# Altium schematic sheet Sheet2.SchDoc
size A4
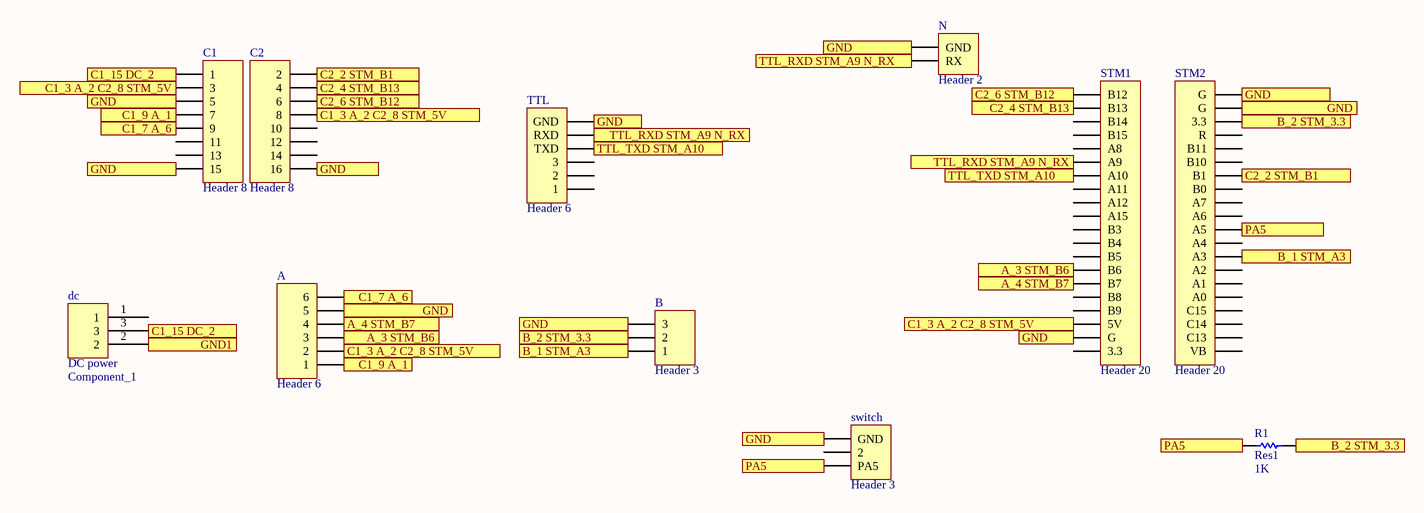
[diagram p0: Sheet2.SchDoc]

## Parts
A  Header 6  [HDR1X6]
B  Header 3  [HDR1X3]
C1  Header 8  [HDR1X8]
C2  Header 8  [HDR1X8]
dc  Component_1  [PCBComponent_1]
N  Header 2  [HDR1X2]
R1  Res1  value 1K  [AXIAL-0.3]
STM1  Header 20  [HDR1X20]
STM2  Header 20  [HDR1X20]
switch  Header 3  [HDR1X3]
TTL  Header 6  [HDR1X6]

## Ports
A_3 STM_B6, A_4 STM_B7, B_1 STM_A3, B_2 STM_3.3, C1_3 A_2 C2_8 STM_5V, C1_7 A_6, C1_9 A_1, C1_15 DC_2, C2_2 STM_B1, C2_4 STM_B13, C2_6 STM_B12, GND, GND1, PA5, TTL_RXD STM_A9 N_RX, TTL_TXD STM_A10

## Nets
A_3 STM_B6: A.3 STM1.14(B6) ; port A_3 STM_B6
A_4 STM_B7: A.4 STM1.15(B7) ; port A_4 STM_B7
B_1 STM_A3: B.3(1) STM2.8(A3) ; port B_1 STM_A3
B_2 STM_3.3: B.2 R1.2 STM2.18(3.3) ; port B_2 STM_3.3
C1_3 A_2 C2_8 STM_5V: A.2 C1.2(3) C2.5(8) STM1.18(5V) ; port C1_3 A_2 C2_8 STM_5V
C1_7 A_6: A.6 C1.5(9) ; port C1_7 A_6
C1_9 A_1: A.1 C1.4(7) ; port C1_9 A_1
C1_15 DC_2: C1.1 dc.3 ; port C1_15 DC_2
C2_2 STM_B1: C2.8(2) STM2.14(B1) ; port C2_2 STM_B1
C2_4 STM_B13: C2.7(4) STM1.2(B13) ; port C2_4 STM_B13
C2_6 STM_B12: C2.6 STM1.1(B12) ; port C2_6 STM_B12
GND: A.5 B.1(3) C1.3(5) C1.8(15) C2.1(16) N.1(GND) STM1.19(G) STM2.19(G) STM2.20(G) switch.1(GND) TTL.6(GND) ; port GND
GND1: dc.2 ; port GND1
PA5: R1.1 STM2.10(A5) switch.3(PA5) ; port PA5
TTL_RXD STM_A9 N_RX: N.2(RX) STM1.6(A9) TTL.5(RXD) ; port TTL_RXD STM_A9 N_RX
TTL_TXD STM_A10: STM1.7(A10) TTL.4(TXD) ; port TTL_TXD STM_A10

Not connected (* = marked no-connect by the designer): C1 6(11) 7(13); C2 2(14) 3(12) 4(10); dc 1; STM1 3(B14) 4(B15) 5(A8) 8(A11) 9(A12) 10(A15) 11(B3) 12(B4) 13(B5) 16(B8) 17(B9) 20(3.3); STM2 1(VB) 2(C13) 3(C14) 4(C15) 5(A0) 6(A1) 7(A2) 9(A4) 11(A6) 12(A7) 13(B0) 15(B10) 16(B11) 17(R); switch 2; TTL 1 2 3

## Notes on the sheet
- (in symbol Component_1) DC power

## Library data of the parts
A TTL = Header 6: Header, 6-Pin; LatestRevisionDate: 17-Jul-2002; LatestRevisionNote: Re-released for DXP Platform.; Publisher: Altium Limited
B switch = Header 3: Header, 3-Pin; LatestRevisionDate: 17-Jul-2002; LatestRevisionNote: Re-released for DXP Platform.; Publisher: Altium Limited
C1 C2 = Header 8: Header, 8-Pin; LatestRevisionDate: 17-Jul-2002; LatestRevisionNote: Re-released for DXP Platform.; Publisher: Altium Limited
N = Header 2: Header, 2-Pin; LatestRevisionDate: 17-Jul-2002; LatestRevisionNote: Re-released for DXP Platform.; Publisher: Altium Limited
R1 = Res1: Resistor; Published: 8-Jun-2000; LatestRevisionDate: 17-Jul-2002; LatestRevisionNote: Re-released for DXP Platform.; PackageReference: AXIAL-0.3; Publisher: Altium Limited; PackageDescription: Axial Device, Thru-Hole; 2 Leads; 0.3 in Pin Spacing
STM1 STM2 = Header 20: Header, 20-Pin; LatestRevisionDate: 17-Jul-2002; LatestRevisionNote: Re-released for DXP Platform.; Publisher: Altium Limited